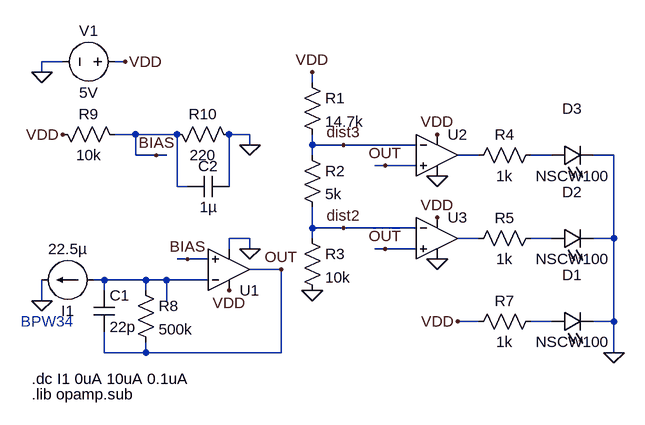
[diagram p0: schematic analog-scheme-real.asc]
analog-scheme-real.asc, the LTspice schematic file:
Version 4.1
SHEET 1 1024 848
WIRE -416 176 -448 176
WIRE -320 176 -336 176
WIRE -448 192 -448 176
WIRE -32 208 -32 192
WIRE -304 288 -336 288
WIRE -240 288 -304 288
WIRE -128 288 -160 288
WIRE -128 304 -128 288
WIRE -32 304 -32 288
WIRE 16 304 -32 304
WIRE 128 304 16 304
WIRE -304 320 -304 288
WIRE -272 320 -304 320
WIRE -256 320 -272 320
WIRE -32 320 -32 304
WIRE 224 320 192 320
WIRE 336 320 304 320
WIRE 432 320 400 320
WIRE 80 336 64 336
WIRE 128 336 80 336
WIRE -240 368 -240 288
WIRE -224 368 -240 368
WIRE -160 368 -160 288
WIRE -32 432 -32 400
WIRE 16 432 -32 432
WIRE 128 432 16 432
WIRE -128 448 -160 448
WIRE -32 448 -32 432
WIRE 224 448 192 448
WIRE 336 448 304 448
WIRE 432 448 432 320
WIRE 432 448 400 448
WIRE -160 464 -160 448
WIRE -128 464 -128 448
WIRE 80 464 64 464
WIRE 128 464 80 464
WIRE -224 480 -240 480
WIRE -192 480 -224 480
WIRE -80 496 -128 496
WIRE -352 512 -368 512
WIRE -288 512 -352 512
WIRE -256 512 -288 512
WIRE -192 512 -256 512
WIRE -352 528 -352 512
WIRE -288 528 -288 512
WIRE -448 544 -448 512
WIRE -256 544 -256 512
WIRE 224 576 192 576
WIRE 336 576 304 576
WIRE 432 576 432 448
WIRE 432 576 400 576
WIRE -352 624 -352 592
WIRE -288 624 -288 608
WIRE -288 624 -352 624
WIRE -80 624 -80 496
WIRE -80 624 -288 624
WIRE 432 624 432 576
FLAG -128 464 0
FLAG -448 192 0
FLAG -448 544 0
FLAG -32 528 0
FLAG 432 624 0
FLAG 160 352 0
FLAG 160 480 0
FLAG -160 528 VDD
FLAG 160 288 VDD
FLAG 160 416 VDD
FLAG 192 576 VDD
FLAG -128 304 0
FLAG -80 496 OUT
FLAG -272 320 BIAS
FLAG 16 304 dist3
FLAG 16 432 dist2
FLAG -320 176 VDD
FLAG -416 288 VDD
FLAG -224 480 BIAS
FLAG 80 464 OUT
FLAG 80 336 OUT
FLAG -32 192 VDD
SYMBOL current -368 512 M270
WINDOW 0 -32 40 VBottom 2
WINDOW 3 32 40 VTop 2
WINDOW 123 0 0 Left 0
WINDOW 39 0 0 Left 0
SYMATTR InstName I1
SYMATTR Value 22.5µ
SYMBOL res -48 192 R0
SYMATTR InstName R1
SYMATTR Value 14.7k
SYMBOL res -48 304 R0
SYMATTR InstName R2
SYMATTR Value 5k
SYMBOL res -48 432 R0
SYMATTR InstName R3
SYMATTR Value 10k
SYMBOL LED 336 592 R270
WINDOW 0 72 32 VTop 2
WINDOW 3 0 32 VBottom 2
SYMATTR InstName D1
SYMATTR Value NSCW100
SYMBOL LED 336 464 R270
WINDOW 0 72 32 VTop 2
WINDOW 3 0 32 VBottom 2
SYMATTR InstName D2
SYMATTR Value NSCW100
SYMBOL LED 336 336 R270
WINDOW 0 72 32 VTop 2
WINDOW 3 0 32 VBottom 2
SYMATTR InstName D3
SYMATTR Value NSCW100
SYMBOL OpAmps\\UniversalOpAmp2 -160 496 M180
SYMATTR InstName U1
SYMBOL OpAmps\\UniversalOpAmp2 160 320 R0
SYMATTR InstName U2
SYMBOL OpAmps\\UniversalOpAmp2 160 448 R0
SYMATTR InstName U3
SYMBOL res -320 304 M270
WINDOW 0 32 56 VTop 2
WINDOW 3 0 56 VBottom 2
SYMATTR InstName R9
SYMATTR Value 10k
SYMBOL res -144 304 M270
WINDOW 0 32 56 VTop 2
WINDOW 3 0 56 VBottom 2
SYMATTR InstName R10
SYMATTR Value 220
SYMBOL cap -224 352 M90
WINDOW 0 0 32 VBottom 2
WINDOW 3 32 32 VTop 2
SYMATTR InstName C2
SYMATTR Value 1µ
SYMBOL res 320 560 R90
WINDOW 0 0 56 VBottom 2
WINDOW 3 32 56 VTop 2
SYMATTR InstName R7
SYMATTR Value 1k
SYMBOL res -304 512 R0
SYMATTR InstName R8
SYMATTR Value 500k
SYMBOL cap -368 528 R0
SYMATTR InstName C1
SYMATTR Value 22p
SYMBOL voltage -320 176 R90
WINDOW 0 -32 56 VBottom 2
WINDOW 3 32 56 VTop 2
SYMATTR InstName V1
SYMATTR Value 5V
SYMBOL res 320 304 R90
WINDOW 0 0 56 VBottom 2
WINDOW 3 32 56 VTop 2
SYMATTR InstName R4
SYMATTR Value 1k
SYMBOL res 320 432 R90
WINDOW 0 0 56 VBottom 2
WINDOW 3 32 56 VTop 2
SYMATTR InstName R5
SYMATTR Value 1k
TEXT -464 664 Left 2 !.dc I1 0uA 10uA 0.1uA
TEXT -464 688 Left 2 !.lib opamp.sub
TEXT -440 576 Center 2 ;BPW34

The netlist it stands for:
* analog-scheme-real.asc
I1 N005 0 22.5µ
R1 VDD dist3 14.7k
R2 dist3 dist2 5k
R3 dist2 0 10k
D1 N006 0 NSCW100
D2 N004 0 NSCW100
D3 N002 0 NSCW100
X§U1 BIAS N005 VDD 0 OUT level2 Avol=1Meg GBW=10Meg Slew=10Meg Ilimit=25m Rail=0 Vos=0 En=0 Enk=0 In=0 Ink=0 Rin=500Meg  ; pins In+ In- V+ V- OUT
X§U2 OUT dist3 VDD 0 N001 level2 Avol=1Meg GBW=10Meg Slew=10Meg Ilimit=25m Rail=0 Vos=0 En=0 Enk=0 In=0 Ink=0 Rin=500Meg  ; pins In+ In- V+ V- OUT
X§U3 OUT dist2 VDD 0 N003 level2 Avol=1Meg GBW=10Meg Slew=10Meg Ilimit=25m Rail=0 Vos=0 En=0 Enk=0 In=0 Ink=0 Rin=500Meg  ; pins In+ In- V+ V- OUT
R9 BIAS VDD 10k
R10 0 BIAS 220
C2 BIAS 0 1µ
R7 N006 VDD 1k
R8 N005 OUT 500k
C1 N005 OUT 22p
V1 VDD 0 5V
R4 N002 N001 1k
R5 N004 N003 1k
.model D D
.lib standard.dio
.dc I1 0uA 10uA 0.1uA
.lib opamp.sub
* BPW34
.lib UniversalOpAmp2.lib
.backanno
.end